# EAGLE design CAN Breakout 3.0 (EAGLE 9.5.1)
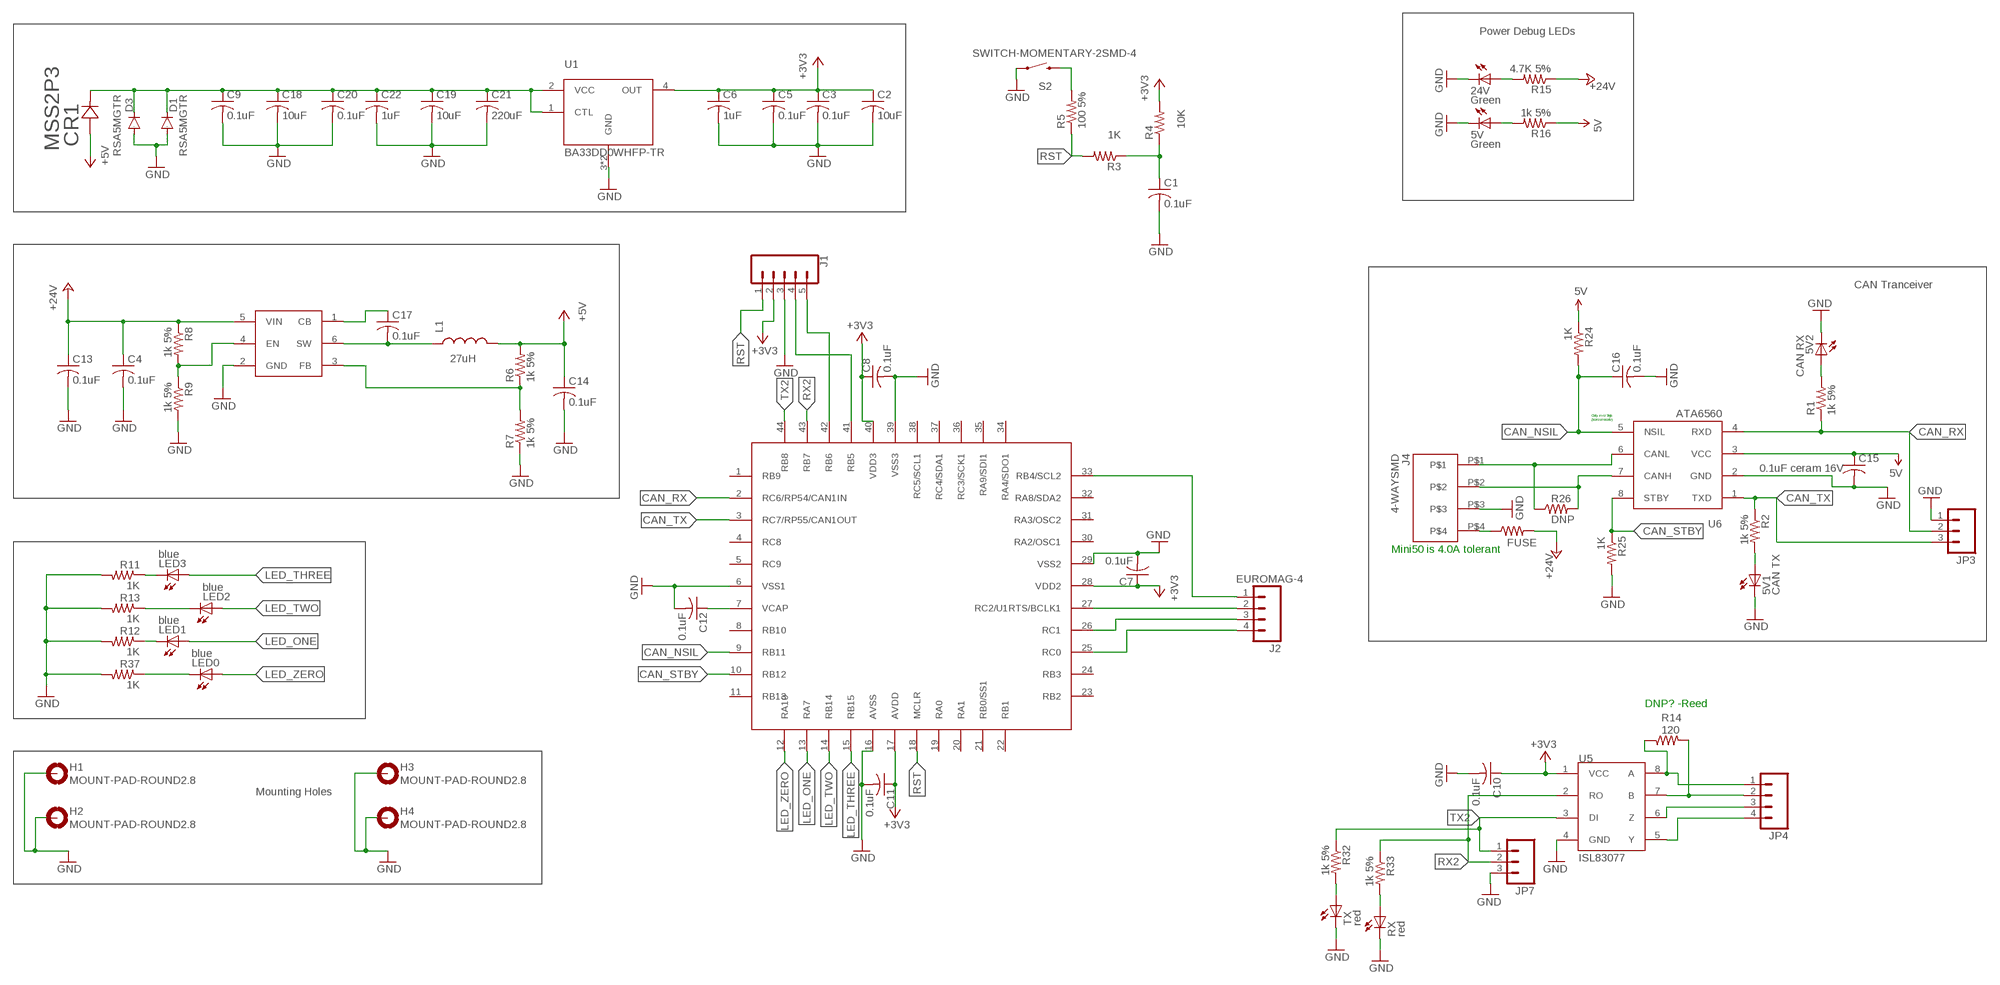
[diagram p0: schematic, sheet 1]

## Parts
5V  Green  LEDCHIP-LED0805  [CHIP-LED0805]
5V1  CAN TX  LEDCHIP-LED0805  [CHIP-LED0805]
5V2  CAN RX  LEDCHIP-LED0805  [CHIP-LED0805]
24V  Green  LEDCHIP-LED0805  [CHIP-LED0805]
C1  0.1uF  C-USC0805  [C0805]
C2  10uF  C-USC0805  [C0805]
C3  0.1uF  C-USC0805  [C0805]
C4  0.1uF  C-USC0805  [C0805]
C5  0.1uF  C-USC0805  [C0805]
C6  1uF  C-USC0805  [C0805]
C7  0.1uF  C-USC0805  [C0805]
C8  0.1uF  C-USC0805  [C0805]
C9  0.1uF  C-USC0805  [C0805]
C10  0.1uF  C-USC0805  [C0805]
C11  0.1uF  C-USC0805  [C0805]
C12  0.1uF  C-USC0805  [C0805]
C13  0.1uF  C-USC0805  [C0805]
C14  0.1uF  C-USC0805  [C0805]
C15  0.1uF ceram 16V  C-USC0805  [C0805]
C16  0.1uF  C-USC0805  [C0805]
C17  0.1uF  C-USC0805  [C0805]
C18  10uF  C-USC0805  [C0805]
C19  10uF  C-USC0805  [C0805]
C20  0.1uF  C-USC0805  [C0805]
C21  220uF  C-USC0805  [C0805]
C22  1uF  C-USC0805  [C0805]
CR1  MSS2P3  MSS2P3-M3/89ADIODE_MSP3V3-L  [DIODE_MSP3V3-L]
D1  RSA5MGTR  CGRM4004-G  [SOD-123_MINI-SMA]
D3  RSA5MGTR  CGRM4004-G  [SOD-123_MINI-SMA]
FUSE  RESISTOR1206  [1206]
H1  MOUNT-PAD-ROUND2.8  [2,8-PAD]
H2  MOUNT-PAD-ROUND2.8  [2,8-PAD]
H3  MOUNT-PAD-ROUND2.8  [2,8-PAD]
H4  MOUNT-PAD-ROUND2.8  [2,8-PAD]
J1  CONN_05  [1X05]
J2  EUROMAG-4  [M4]
J4  4-WAYSMD  [4-WAY-SMD-90D]
JP3  M03LOCK  [1X03_LOCK]
JP4  M04POLAR_LOCK  [MOLEX-1X4_LOCK]
JP7  M03LOCK  [1X03_LOCK]
L1  27uH  INDUCTOR1  [0805]
LED0  blue  LEDCHIPLED_0805  [CHIPLED_0805]
LED1  blue  LEDCHIPLED_0805  [CHIPLED_0805]
LED2  blue  LEDCHIPLED_0805  [CHIPLED_0805]
LED3  blue  LEDCHIPLED_0805  [CHIPLED_0805]
R1  1k 5%  R-US_M0805  [M0805]
R2  1k 5%  R-US_M0805  [M0805]
R3  1K  R-US_M0805  [M0805]
R4  10K  R-US_M0805  [M0805]
R5  100 5%  R-US_M0805  [M0805]
R6  1k 5%  R-US_M0805  [M0805]
R7  1k 5%  R-US_M0805  [M0805]
R8  1k 5%  R-US_M0805  [M0805]
R9  1k 5%  R-US_M0805  [M0805]
R11  1K  R-US_M0805  [M0805]
R12  1K  R-US_M0805  [M0805]
R13  1K  R-US_M0805  [M0805]
R14  120  R-US_M0805  [M0805]
R15  4.7K 5%  R-US_M0805  [M0805]
R16  1k 5%  R-US_M0805  [M0805]
R24  1K  R-US_M0805  [M0805]
R25  1K  R-US_M0805  [M0805]
R26  DNP  R-US_M0805  [M0805]
R32  1k 5%  R-US_M0805  [M0805]
R33  1k 5%  R-US_M0805  [M0805]
R37  1K  R-US_M0805  [M0805]
RX  red  LEDCHIP-LED0805  [CHIP-LED0805]
S2  SWITCH-MOMENTARY-2SMD-4  [TACTILE_SWITCH_TALL]
TX  red  LEDCHIP-LED0805  [CHIP-LED0805]
U1  BA33DD0WHFP-TR  [HRP5]
U2  DSPIC33EP512GP504  [TQFP-44]
U5  ISL83077  [SO08]
U6  ATA6560  [SOIC8]
U7  TPS560430YDBVR  [SOT23-6]

## Nets
5V [New Class]: C15.1 R16.1 R24.1 U6.3(VCC)
+3V3 [New Class]: C2.1 C3.1 C5.1 C6.1 C7.1 C8.1 C10.1 C11.1 J1.2 R4.2 U1.4(OUT) U2.17(AVDD) U2.28(VDD2) U2.40(VDD3) U5.1(VCC)
+5V [New Class]: C14.1 CR1.2 L1.2 R6.2
+24V [New Class]: C4.1 C13.1 FUSE.2 R8.1 R15.1 U7.5(VIN)
CAN_NSIL [New Class]: C16.1 R24.2 U2.9(RB11) U6.5(NSIL)
CAN_RX [New Class]: JP3.2 R1.1 U2.2(RC6/RP54/CAN1IN) U6.4(RXD)
CAN_STBY [New Class]: R25.1 U2.10(RB12) U6.8(STBY)
CAN_TX [New Class]: JP3.3 R2.1 U2.3(RC7/RP55/CAN1OUT) U6.1(TXD)
GND: 5V1.C 5V2.C 5V.C 24V.C C1.2 C2.2 C3.2 C4.2 C5.2 C6.2 C7.2 C8.2 C9.2 C10.2 C11.2 C12.2 C13.2 C14.2 C15.2 C16.2 C18.2 C19.2 C20.2 C21.2 C22.2 D1.A D3.A H1.B2,8(MOUNT) H2.B2,8(MOUNT) H3.B2,8(MOUNT) H4.B2,8(MOUNT) J1.3 J4.P$3 JP3.1 JP7.3 R7.1 R9.2 R11.2 R12.2 R13.2 R25.2 R37.2 RX.C S2.A2 TX.C U1.3(GND) U1.G(GND) U2.6(VSS1) U2.16(AVSS) U2.29(VSS2) U2.39(VSS3) U5.4(GND) U6.2(GND) U7.2(GND)
LED_ONE [New Class]: LED1.A U2.13(RA7)
LED_THREE [New Class]: LED3.A U2.15(RB15)
LED_TWO [New Class]: LED2.A U2.14(RB14)
LED_ZERO [New Class]: LED0.A U2.12(RA10)
N$1 [New Class]: 24V.A R15.2
N$2 [New Class]: J1.5 U2.42(RB6)
N$3 [New Class]: J2.2 U2.27(RC2/U1RTS/BCLK1)
N$4 [New Class]: J1.4 U2.41(RB5)
N$5 [New Class]: J2.3 U2.26(RC1)
N$6 [New Class]: C9.1 C18.1 C19.1 C20.1 C21.1 C22.1 CR1.1 D1.C D3.C U1.1(CTL) U1.2(VCC)
N$7 [New Class]: J2.1 U2.33(RB4/SCL2)
N$8 [New Class]: 5V2.A R1.2
N$9 [New Class]: J2.4 U2.25(RC0)
N$10 [New Class]: 5V.A R16.2
N$11 [New Class]: 5V1.A R2.2
N$12 [New Class]: LED0.C R37.1
N$14 [New Class]: LED2.C R13.1
N$15 [New Class]: J4.P$1 R26.1 U6.6(CANL)
N$16 [New Class]: LED1.C R12.1
N$17 [New Class]: R5.2 S2.B2
N$18 [New Class]: C1.1 R3.1 R4.1
N$19: FUSE.1 J4.P$4
N$20 [New Class]: JP4.2 R14.2 U5.7(B)
N$23 [New Class]: JP4.1 R14.1 U5.8(A)
N$24 [New Class]: JP4.3 U5.6(Z)
N$25 [New Class]: JP4.4 U5.5(Y)
N$27 [New Class]: LED3.C R11.1
N$29 [New Class]: C17.2 L1.1 U7.6(SW)
N$31 [New Class]: R8.2 R9.1 U7.4(EN)
N$32 [New Class]: C17.1 U7.1(CB)
N$33 [New Class]: R6.1 R7.2 U7.3(FB)
N$35 [New Class]: R32.2 TX.A
N$36 [New Class]: J4.P$2 R26.2 U6.7(CANH)
N$37 [New Class]: C12.1 U2.7(VCAP)
N$43 [New Class]: R33.2 RX.A
RST [New Class]: J1.1 R3.2 R5.1 U2.18(MCLR)
RX2 [New Class]: JP7.2 R33.1 U2.43(RB7) U5.2(RO)
TX2 [New Class]: JP7.1 R32.1 U2.44(RB8) U5.3(DI)
Unconnected: U2.1(RB9) U2.4(RC8) U2.5(RC9) U2.8(RB10) U2.11(RB13) U2.19(RA0) U2.20(RA1) U2.21(RB0/SS1) U2.22(RB1) U2.23(RB2) U2.24(RB3) U2.30(RA2/OSC1) U2.31(RA3/OSC2) U2.32(RA8/SDA2) U2.34(RA4/SDO1) U2.35(RA9/SDI1) U2.36(RC3/SCK1) U2.37(RC4/SDA1) U2.38(RC5/SCL1)

## Notes on the sheet
- Power Debug LEDs
- CAN Tranceiver
- Only ever high 
    (normal mode)
- Mini50 is 4.0A tolerant
- DNP? -Reed
- Mounting Holes

## Library data of the parts
5V 5V1 5V2 24V LED0 LED1-LED3 RX TX = adafruit:LED: LED OSRAM: - CHIPLED LG R971, LG N971, LY N971, LG Q971, LY Q971, LO R971, LY R971 LH N974, LH R974 LS Q976, LO Q976, LY Q976 LO Q996 - Hyper CHIPLED LW Q18S LB Q993, LB Q99A, LB R99A - SideLED LS A670, LO A670, LY A670, LG A670, LP A670 LB A673, LV A673, LT A673, LW A673 LH A674 LY A675 LS A676, LA A676, LO A676, LY A676, LW A676 LS A679, LY A679, LG A679 - Hyper Micro SIDELED® LS Y876, LA Y876, LO Y876, LY Y876 LT Y87S - SmartLED LW L88C, LW L88S LB L89C, LB L89S, LG L890 LS L89K, LO L89K, LY L89K LS L896, LA L896, LO L896, LY L896 - TOPLED LS T670, LO T670, LY T670, LG T670, LP T670 LSG T670, LSP T670, LSY T670, LOP T670, LYG T670 LG T671, LOG T671, LSG T671 LB T673, LV T673, LT T673, LW T673 LH T674 LS T676, LA T676, LO T676, LY T676, LB T676, LH T676, LSB T676, LW T676 LB T67C, LV T67C, LT T67C, LS T67K, LO T67K, LY T67K, LW E67C LS E67B, LA E67B, LO E67B, LY E67B, LB E67C, LV E67C, LT E67C LW T67C LS T679, LY T679, LG T679 LS T770, LO T770, LY T770, LG T770, LP T770 LB T773, LV T773, LT T773, LW T773 LH T774 LS E675, LA E675, LY E675, LS T675 LS T776, LA T776, LO T776, LY T776, LB T776 LHGB T686 LT T68C, LB T68C - Hyper Mini TOPLED® LB M676 - Mini TOPLED Santana® LG M470 LS M47K, LO M47K, LY M47K Source: http://www.osram.convergy.de/
C1-C22 = adafruit:C-US: CAPACITOR, American symbol
CR1 = MICRO-SMP:MSS2P3-M3/89A; MANUFACTURER_PART_NUMBER: MSS2P3M389A; VENDOR: Vishay
D1 D3 = diode:CGRM400*-G: Molded plasitc,JEDEC SOD-123/Mini SMA Source: Comchip CGRM4001-G.pdf
FUSE = SparkFun-Resistors:RESISTOR: Resistor Basic schematic elements and footprints for 0603, 1206, and PTH resistors.
H1-H4 = holes:MOUNT-PAD-ROUND: MOUNTING PAD, round
J1 = SparkFun-Connectors:CONN_05: Multi connection point. Often used as Generic Header-pin footprint for 0.1 inch spaced/style header connections On any of the 0.1 inch spaced packages, you can populate with these: Break Away Headers - Straight <https://www.sparkfun.com/products/116> (PRT-00116) Break Away Male Headers - Right Angle <https://www.sparkfun.com/products/553> (PRT-00553) Female Headers <https://www.sparkfun.com/products/115> (PRT-00115) Break Away Headers - Machine Pin <https://www.sparkfun.com/products/117> (PRT-00117) Break Away Female Headers - Swiss Machine Pin <https://www.sparkfun.com/products/743> (PRT-00743) For SCREWTERMINALS and SPRING TERMINALS visit here: Screw Terimnals on SparkFun.com <https://www.sparkfun.com/search/results?term=Screw+Terminals> (5mm/3.5mm/2.54mm spacing) This device is also useful as a general connection point to wire up your design to another part of your project. Our various solder wires solder well into these plated through hole pads. Hook-Up Wire - Assortment (Stranded, 22 AWG) <https://www.sparkfun.com/products/11375> (PRT-11375) Hook-Up Wire - Assortment (Solid Core, 22 AWG) <https://www.sparkfun.com/products/11367> (PRT-11367) View the entire wire category on our website here <https://www.sparkfun.com/categories/141> Special notes: Molex polarized connector foot print use with SKU : PRT-08231 with associated crimp pins and housings. 1MM SMD Version SKU: PRT-10208
J2 = NASA_LIB_08-24-17:EUROMAG-4
J4 = Molex-Auto-Connector:4-WAY
JP3 JP7 = SparkFun-Connectors:M03: Header 3 Standard 3-pin 0.1" header. Use with straight break away headers (SKU : PRT-00116), right angle break away headers (PRT-00553), swiss pins (PRT-00743), machine pins (PRT-00117), and female headers (PRT-00115). Molex polarized connector foot print use with SKU : PRT-08232 with associated crimp pins and housings.
JP4 = SparkFun-Connectors:M04: Header 4 Standard 4-pin 0.1" header. Use with straight break away headers (SKU : PRT-00116), right angle break away headers (PRT-00553), swiss pins (PRT-00743), machine pins (PRT-00117), and female headers (PRT-00115). Molex polarized connector foot print use with SKU : PRT-08231 with associated crimp pins and housings. 1MM SMD Version SKU: PRT-10208
L1 = UA_NASA_RMC-Inductors:INDUCTOR
R1-R9 R11-R16 R24-R26 R32 R33 R37 = adafruit:R-US_: RESISTOR, American symbol
S2 = SparkFun-Electromechanical:SWITCH-MOMENTARY-2: Various NO switches- pushbuttons, reed, etc; PROD_ID: SWCH-11966
U1 = NASA_LIB_08-24-17:BA33DD0WHFP-TR
U2 = NASA_LIB_08-24-17:DSPIC33EP512GP504
U5 = NASA_LIB:ISL83077
U6 = NASAAtmel:ATA6560
U7 = adafruit_2:TPS560430YDBVR

## Board
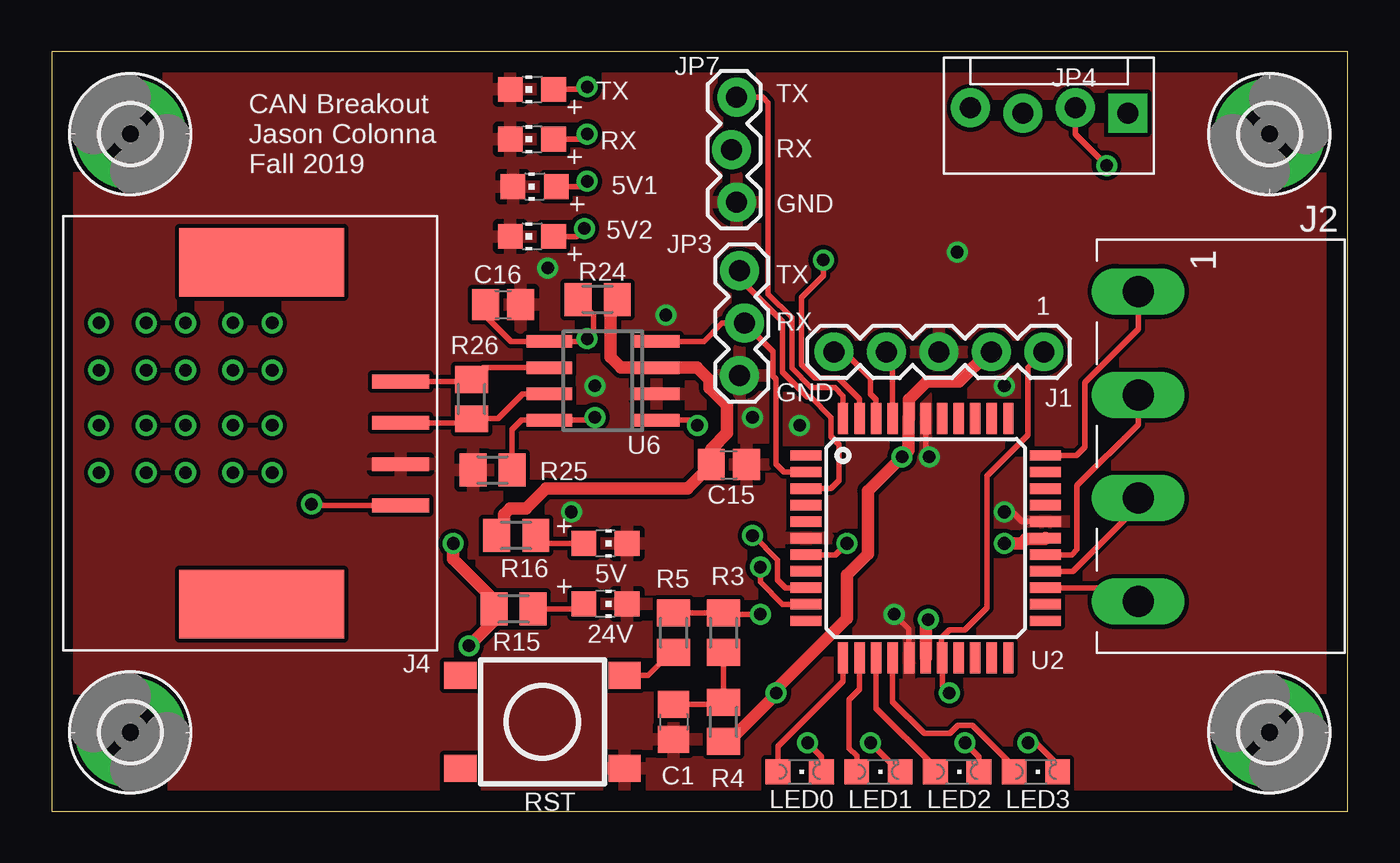
[diagram p1: board, top side]
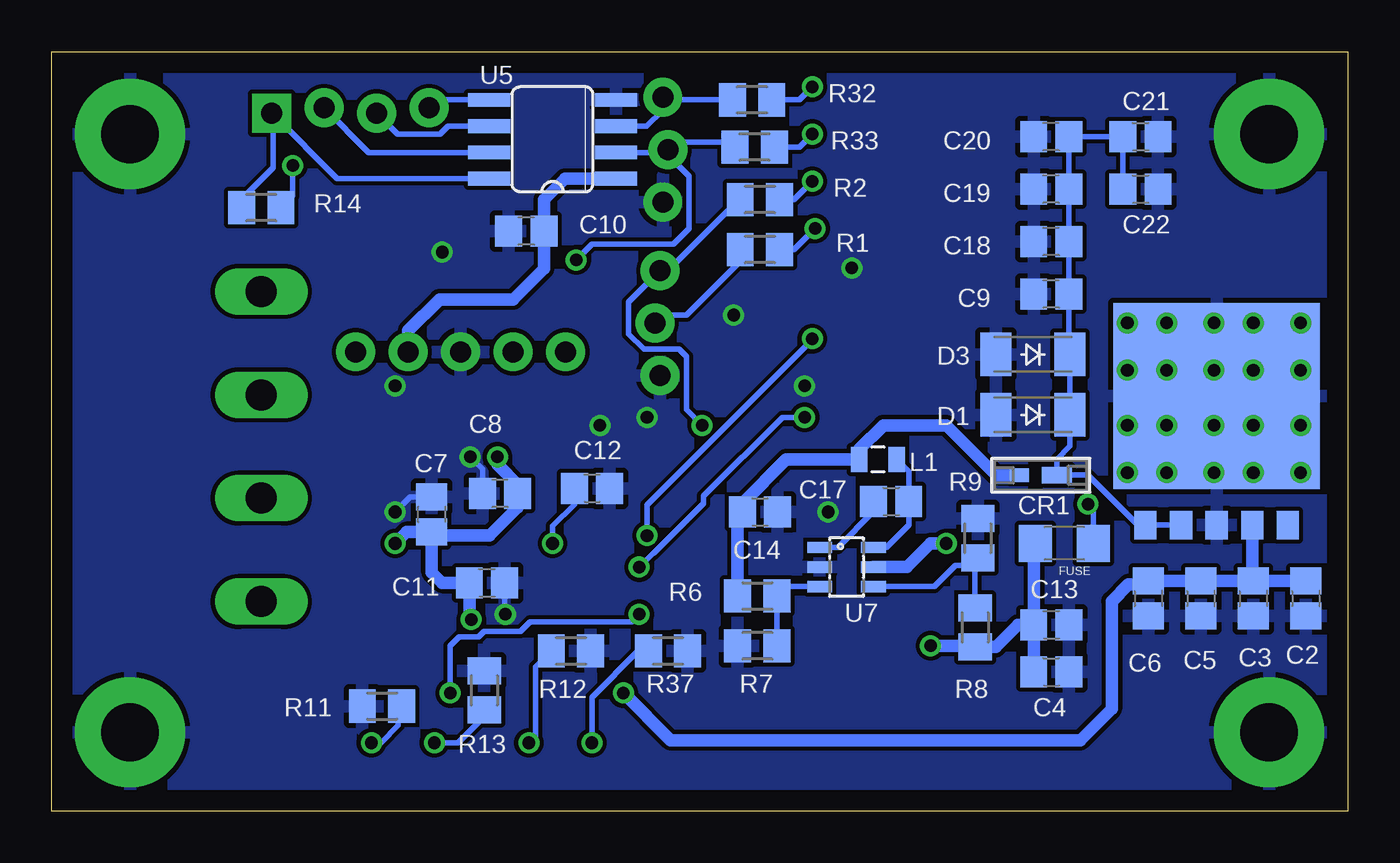
[diagram p2: board, bottom side, seen from below]

Size 62.72 x 36.75 mm. Coordinates in mm from the lower left corner, seen from the top.
Outline: 0,0 62.72,0 62.72,36.75 0,36.75 0,0
Copper layers (1*16): Top 0.035mm / dielectric 1.5mm / Bottom 0.035mm
Design rules "default *": minimum track width 10mil, minimum drill 24mil, track to track 8mil, track to pad 8mil, pad to pad 8mil, via to via 8mil, smd to smd 8mil, copper to edge 40mil, drill to drill 8mil, minimum pad ring 10mil, minimum via ring 8mil, stop-mask expansion 4mil, vias tented up to drill 0mil, thermal gap 10mil

### Footprints (pad centres in the part's own frame; a part is rotated, then mirrored left to right if it is on the bottom)
CHIP-LED0805 = smd 1.2 x 1.2: A 0,-1.05; C 0,1.05
C0805 = smd 1.3 x 1.5: 1 -0.85,0; 2 0.85,0
DIODE_MSP3V3-L = smd 1.448 x 0.787: 1 -0.775,0 | smd 0.914 x 0.66: 2 1.041,0
SOD-123_MINI-SMA = smd 1.5 x 2.1: A 1.8,0; C -1.8,0
1206 = smd 1.6 x 1.8: 1 -1.4,0; 2 1.4,0
2,8-PAD = drill 2.8 pad 5.334: B2,8 0,0
1X05 = drill 1.016 pad 1.88: 1 0,0; 2 2.54,0; 3 5.08,0; 4 7.62,0; 5 10.16,0
M4 = drill 1.5 long: 1 0,0; 2 5,0; 3 10,0; 4 15,0
4-WAY-SMD-90D = smd 0.66 x 2.75: P$1 -2.5,6.72; P$2 -0.5,6.72; P$3 1.5,6.72; P$4 3.5,6.72 | smd 3.32 x 8: P$5 -8.27,0; P$6 8.27,0
1X03_LOCK = drill 1.016 pad 1.88: 1 0,0.127; 2 2.54,-0.127; 3 5.08,0.127
MOLEX-1X4_LOCK = drill 1.016 pad 1.88 square: 1 0,0.127 | drill 1.016 pad 1.88: 2 2.54,-0.127; 3 5.08,0.127; 4 7.62,-0.127
0805 = smd 0.8 x 1.2: 1 -0.9,0; 2 0.9,0
CHIPLED_0805 = smd 1.2 x 1.2: A 0,-1.05; C 0,1.05
M0805 = smd 1.3 x 1.6: 1 -0.95,0; 2 0.95,0
TACTILE_SWITCH_TALL = smd 1.55 x 1.3: A1 -3.975,-2.25; A2 3.975,-2.25; B1 -3.975,2.25; B2 3.975,2.25
HRP5 = smd 1.07 x 1.37: 1 -3.44,0; 2 -1.72,0; 3 0,0; 4 1.72,0; 5 3.44,0 | smd 10 x 9: G 0,6.254
TQFP-44 = smd 1.5 x 0.5: 1 -5.8,4; 2 -5.8,3.2; 3 -5.8,2.4; 4 -5.8,1.6; 5 -5.8,0.8; 6 -5.8,0; 7 -5.8,-0.8; 8 -5.8,-1.6; 9 -5.8,-2.4; 10 -5.8,-3.2; 11 -5.8,-4; 23 5.8,-4; 24 5.8,-3.2; 25 5.8,-2.4; 26 5.8,-1.6; 27 5.8,-0.8; 28 5.8,0; 29 5.8,0.8; 30 5.8,1.6; 31 5.8,2.4; 32 5.8,3.2; 33 5.8,4 | smd 0.5 x 1.5: 12 -4,-5.8; 13 -3.2,-5.8; 14 -2.4,-5.8; 15 -1.6,-5.8; 16 -0.8,-5.8; 17 0,-5.8; 18 0.8,-5.8; 19 1.6,-5.8; 20 2.4,-5.8; 21 3.2,-5.8; 22 4,-5.8; 34 4,5.8; 35 3.2,5.8; 36 2.4,5.8; 37 1.6,5.8; 38 0.8,5.8; 39 0,5.8; 40 -0.8,5.8; 41 -1.6,5.8; 42 -2.4,5.8; 43 -3.2,5.8; 44 -4,5.8
SO08 = smd 0.66 x 2.032: 1 -1.905,-3.073; 2 -0.635,-3.073; 3 0.635,-3.073; 4 1.905,-3.073; 5 1.905,3.073; 6 0.635,3.073; 7 -0.635,3.073; 8 -1.905,3.073
SOIC8 = smd 0.6 x 2.2: 1 -1.905,-2.6; 2 -0.635,-2.6; 3 0.635,-2.6; 4 1.905,-2.6; 5 1.905,2.6; 6 0.635,2.6; 7 -0.635,2.6; 8 -1.905,2.6
SOT23-6 = smd 0.55 x 1.2: 1 -0.95,-1.3; 2 0,-1.3; 3 0.95,-1.3; 4 0.95,1.3; 5 0,1.3; 6 -0.95,1.3

### Placement (x,y rotation side)
5V  26.8,12.95 270 top
5V1  23.37,30.23 90 top
5V2  23.24,27.81 90 top
24V  26.8,10.03 270 top
C1  30.1,4.32 270 top
C2  2.03,10.29 270 bottom
C3  4.57,10.29 270 bottom
C4  14.35,6.73 0 bottom
C5  7.11,10.29 270 bottom
C6  9.65,10.29 270 bottom
C7  44.32,14.35 90 bottom
C8  41.02,15.37 180 bottom
C9  14.35,25.02 180 bottom
C10  39.75,28.07 180 bottom
C11  41.66,11.05 0 bottom
C12  36.58,15.62 0 bottom
C13  14.35,9.02 0 bottom
C14  28.45,14.48 0 bottom
C15  32.77,16.76 0 top
C16  21.84,24.51 0 top
C17  22.1,14.99 0 bottom
C18  14.35,27.56 180 bottom
C19  14.35,30.1 180 bottom
C20  14.35,32.64 180 bottom
C21  10.03,32.64 0 bottom
C22  10.03,30.1 0 bottom
CR1  14.86,16.26 180 bottom
D1  15.24,19.18 180 bottom
D3  15.24,22.1 180 bottom
FUSE  13.72,12.95 180 bottom
H1  58.93,3.81 90 top
H2  58.93,32.77 0 top
H3  3.81,32.77 270 top
H4  3.81,3.81 90 top
J1  48.01,22.23 180 top
J2  52.58,25.15 270 top
J4  10.16,18.29 270 top
JP3  33.4,21.08 90 top
JP4  52.07,33.91 180 top
JP7  33.02,34.54 270 top
L1  22.73,17.02 180 bottom
LED0  36.2,1.91 270 top
LED1  40.01,1.91 270 top
LED2  43.81,1.91 270 top
LED3  47.62,1.91 270 top
R1  28.45,27.18 0 bottom
R2  28.45,29.59 0 bottom
R3  32.51,8.64 90 top
R4  32.51,4.32 270 top
R5  30.1,8.64 270 top
R6  28.57,10.41 180 bottom
R7  28.57,8 0 bottom
R8  18.03,8.89 90 bottom
R9  17.91,13.21 90 bottom
R11  46.74,5.08 180 bottom
R12  37.59,7.75 0 bottom
R13  41.78,5.84 90 bottom
R14  52.58,29.21 0 bottom
R15  22.35,9.78 0 top
R16  22.48,13.34 0 top
R24  26.42,24.77 180 top
R25  21.34,16.51 180 top
R26  20.32,19.94 270 top
R32  28.83,34.42 0 bottom
R33  28.7,32.13 0 bottom
R37  32.89,7.75 0 bottom
RX  23.24,32.51 90 top
S2  23.75,4.32 0 top
TX  23.24,34.92 90 top
U1  6.35,13.84 0 bottom
U2  42.29,13.21 0 top
U5  38.48,32.51 90 bottom
U6  26.67,20.83 90 top
U7  24.26,11.81 270 bottom

### Tracks (layer width: path | path; a pad name or v marks a point on that pad's centre or on a via)
5V
  Top 0.61: R24.1 27.3,24.77 27.05,24.52 27.05,21.97 27.56,21.46 U6.3 31.23,21.46 31.83,20.86 31.83,20.48 32.68,19.63 32.68,18.29 31.92,17.53 C15.1 30.77,15.62 23.93,15.62 22.95,14.64 22.19,14.64 21.89,14.35 21.89,13.96 21.53,13.6 R16.1
+3V3  (via drill 0.61)
  Top 0.61: U2.28 48.05,13.17 47.13,13.17 46.92,12.95 v46.1,12.95 | J1.2 45.35,22.23 43.91,20.78 42.34,20.78 41.49,19.93 U2.40 41.45,19.05 41.45,17.45 v41.15,17.14 39.5,15.49 39.5,12.45 38.48,11.43 38.48,9.32 35.05,5.89 v35.05,5.71 35.05,5.64 32.78,3.37 R4.2 | U2.17 42.29,9.14 v42.41,9.27
  Bottom 0.61: C3.1 C2.1 | C3.1 C5.1 C6.1 9.81,10.98 10.61,10.98 11.43,10.16 11.43,4.95 12.95,3.43 32.77,3.43 v35.05,5.71 | C3.1 4.63,11.2 U1.4 | U5.1 37.88,30.61 38.9,29.59 C10.1 38.9,26.25 40.39,24.77 43.96,24.77 45.47,23.26 J1.2 | v42.41,9.27 42.51,9.36 C11.1 43.81,11.05 44.32,11.56 C7.1 | v46.1,12.95 45.55,13.5 C7.1 | C7.1 44.16,13.34 41.53,13.34 40.17,14.69 C8.1 40.17,15.79 41.15,16.76 v41.15,17.14
+5V
  Bottom 0.61: CR1.2 17.02,16.26 19.43,18.67 22.48,18.67 23.63,17.52 L1.2 27.18,17.02 29.3,14.9 C14.1 29.52,14.25 R6.2
+24V  (via drill 0.61)
  Top 0.61: v19.43,12.95 19.43,12.19 21.4,10.22 R15.1 21.4,9.21 v20.19,8
  Bottom 0.61: U7.5 21.34,11.81 20.19,12.95 v19.43,12.95 | v20.19,8 18.09,8 R8.1 17.04,7.94 15.96,9.02 C13.1 | C13.1 C4.1 | FUSE.2 15.2,12.87 C13.1
CAN_NSIL  (via drill 0.61)
  Top 0.254: C16.1 20.99,23.96 22.23,22.73 U6.5 25.78,22.73 v25.91,22.86 26.23,23.18 26.23,24 R24.2 | U2.9 35.51,10.81 35.13,11.19 35.13,12.16 33.95,13.34 v33.91,13.34
  Bottom 0.254: v33.91,13.34 33.91,14.82 25.91,22.82 v25.91,22.86
CAN_RX
  Top 0.254: U2.2 35.43,16.41 35.05,16.79 35.05,20.9 34.9,21.05 34.9,22.25 JP3.2 32.45,23.62 31.56,22.73 U6.4
  Bottom 0.254: JP3.2 33.15,24 32,24 29.34,26.67 29.34,27.12 R1.1
CAN_STBY  (via drill 0.61)
  Top 0.254: R25.1 22.29,18.48 22.73,18.92 U6.8 26.16,18.92 v26.29,19.05 | U2.10 35.37,10.01 34.29,11.09 v34.29,11.81
  Bottom 0.254: v34.29,11.81 33.6,12.5 33.56,12.5 31.17,14.89 31.17,15.24 27.36,19.05 v26.29,19.05
CAN_TX  (via drill 0.61)
  Top 0.254: U6.1 30.99,18.92 v31.24,18.67 | U2.3 37.71,15.61 38.1,16 38.1,17.73 37.71,18.12 37.71,19.06 36.73,20.04 36.56,20.04 35.36,21.24 35.36,23.7 33.27,25.78 JP3.3
  Bottom 0.254: R2.1 29.46,29.59 32.89,26.16 JP3.3 34.8,24.64 34.8,23.1 34.05,22.35 32.37,22.35 32,21.99 32,19.43 v31.24,18.67
GND  (via drill 0.61)
  Top 0.254: v42.47,17.14 42.29,17.32 U2.39 | U2.16 41.49,8.8 v40.77,9.53 | v46.1,14.48 46.48,14.48 46.95,14.01 U2.29
  Bottom 0.254: v42.47,17.14 41.87,16.55 C8.2 | C11.2 40.81,9.56 v40.77,9.53 | C7.2 45.38,15.2 v46.1,14.48
  other vias: 24,26.29 26.29,20.57 29.72,24 33.91,19.05 36.2,18.67 46.1,20.57 25.15,14.48 43.81,27.05
  pour Bottom: 0.38,36.58 0.38,0.38 62.48,0.38 62.48,36.96 0.76,36.96
  pour Top: 0.38,36.58 0.38,0.38 62.48,0.38 62.48,36.58
LED_ONE
  Top 0.254: LED1.A 38.95,2.67 38.57,3.05 38.57,5.38 39.09,5.9 U2.13
LED_THREE
  Top 0.254: LED3.A 46.58,2.11 44.54,4.14 43.85,4.14 43.47,3.76 42.23,3.76 40.69,5.29 U2.15
LED_TWO
  Top 0.254: LED2.A 42.77,2.11 39.89,4.98 U2.14
LED_ZERO
  Top 0.254: LED0.A 35.15,3.14 38.29,6.29 U2.12
N$1
  Top 0.254: 24V.A 25.49,9.78 R15.2
N$2
  Top 0.254: J1.5 38.35,22.23 39.62,20.95 39.62,20.19 39.89,19.93 U2.42
N$3
  Top 0.254: U2.27 49.37,12.41 49.62,12.66 49.62,15.75 52.58,18.71 J2.2
N$4
  Top 0.254: J1.4 40.69,21.92 U2.41
N$5
  Top 0.254: J2.3 52.58,14.77 49.42,11.61 U2.26
N$6
  Bottom 0.254: C22.1 C21.1 C20.1 C19.1 C18.1 C9.1 13.5,22.16 D3.C D1.C 13.44,17.66 14.08,17.02 CR1.1 12.58,16.26 10.17,13.84 U1.1 U1.2
N$7
  Top 0.254: U2.33 49.59,17.21 50,17.61 50,20.75 52.58,23.33 J2.1
N$8  (via drill 0.61)
  Top 0.254: v25.78,28.19 25.4,27.81 5V2.A
  Bottom 0.254: R1.2 26.8,27.18 v25.78,28.19
N$9
  Top 0.254: U2.25 51.92,10.81 J2.4
N$10
  Top 0.254: 5V.A 23.81,12.95 R16.2
N$11  (via drill 0.61)
  Top 0.254: v25.91,30.48 25.65,30.23 5V1.A
  Bottom 0.254: R2.2 26.8,29.59 v25.91,30.48
N$12  (via drill 0.61)
  Top 0.254: v36.58,3.3 37.24,2.63 LED0.C
  Bottom 0.254: v36.58,3.3 36.58,5.51 34.34,7.75 R37.1
N$13  (via drill 0.61)
  other vias: 2.29,23.62
N$14  (via drill 0.61)
  Top 0.254: v44.2,3.3 44.87,2.63 LED2.C
  Bottom 0.254: R13.1 41.78,4.57 43.05,3.3 v44.2,3.3
N$15
  Top 0.254: J4.P$1 20.22,20.79 R26.1 20.89,21.46 U6.6
N$16  (via drill 0.61)
  Top 0.254: LED1.C 41.02,1.91 v39.62,3.3
  Bottom 0.254: v39.62,3.3 39.3,3.62 39.3,6.99 R12.1
N$17
  Top 0.254: R5.2 29.98,7.69 28.87,6.57 S2.B2
N$18
  Top 0.254: C1.1 32.41,5.17 R4.1 R3.1
N$19  (via drill 0.61)
  Top 0.254: J4.P$4 12.64,14.79 v12.57,14.86
  Bottom 0.254: FUSE.1 12.32,14.6 v12.57,14.86
N$20  (via drill 0.61)
  Top 0.254: v51.05,31.24 49.53,32.77 JP4.2
  Bottom 0.254: U5.7 47.37,31.88 JP4.2 | R14.2 51.05,29.78 v51.05,31.24
N$21  (via drill 0.61)
  other vias: 4.57,23.62
N$22  (via drill 0.61)
  other vias: 2.29,21.34
N$23
  Bottom 0.254: U5.8 48.9,30.61 52.01,33.72 | 52.01,33.72 JP4.1 | R14.1 53.53,29.61 52.01,31.13 52.01,33.72
N$24
  Bottom 0.254: U5.6 43.54,33.15 43.92,32.77 45.97,32.77 JP4.3
N$25
  Bottom 0.254: U5.5 44.07,34.42 JP4.4
N$26  (via drill 0.61)
  other vias: 6.48,23.62
N$27  (via drill 0.61)
  Top 0.254: LED3.C 48.67,2.25 47.62,3.3 v47.24,3.3
  Bottom 0.254: R11.1 45.94,4.92 45.94,4.14 46.78,3.3 v47.24,3.3
N$28  (via drill 0.61)
  other vias: 2.29,18.67
N$29
  Bottom 0.254: L1.1 21.25,16.43 C17.2 21.25,13.85 22.33,12.76 U7.6
N$30  (via drill 0.61)
  other vias: 8.76,23.62
N$31
  Bottom 0.254: U7.4 20,10.86 18.98,11.88 18.29,11.88 R9.1 18.03,12.13 R8.2
N$32
  Bottom 0.254: U7.1 24.68,12.76 22.95,14.49 C17.1
N$33
  Bottom 0.254: U7.3 27.18,10.86 R6.1 R7.2
N$34  (via drill 0.61)
  other vias: 2.29,16.38
N$35  (via drill 0.61)
  Top 0.254: v25.91,35.05 25.78,34.92 TX.A
  Bottom 0.254: R32.2 26.54,34.42 v25.91,35.05
N$36
  Top 0.254: U6.7 22.79,20.19 21.59,18.99 R26.2 20.12,18.79 J4.P$2
N$37  (via drill 0.61)
  Top 0.254: U2.7 37.94,12.41 v38.48,12.95
  Bottom 0.254: C12.1 37.43,14.85 38.48,13.79 v38.48,12.95
N$38  (via drill 0.61)
  other vias: 10.67,23.62
N$39  (via drill 0.61)
  other vias: 6.48,18.67
N$40  (via drill 0.61)
  other vias: 4.57,21.34
N$41  (via drill 0.61)
  other vias: 4.57,18.67
N$42  (via drill 0.61)
  other vias: 4.57,16.38
N$43  (via drill 0.61)
  Top 0.254: v25.91,32.77 25.65,32.51 RX.A
  Bottom 0.254: R33.2 26.54,32.13 v25.91,32.77
N$45  (via drill 0.61)
  other vias: 6.48,21.34
N$47  (via drill 0.61)
  other vias: 6.48,16.38
N$49  (via drill 0.61)
  other vias: 8.76,21.34
N$50  (via drill 0.61)
  other vias: 8.76,18.67
N$51  (via drill 0.61)
  other vias: 8.76,16.38
N$53  (via drill 0.61)
  other vias: 10.67,21.34
N$54  (via drill 0.61)
  other vias: 10.67,18.67
N$55  (via drill 0.61)
  other vias: 10.67,16.38
RST  (via drill 0.61)
  Top 0.254: J1.1 47.24,21.46 47.24,18.21 45.26,16.23 45.26,9.83 44.2,8.76 43.43,8.76 43.05,8.38 43.05,7.45 U2.18 43.09,6.06 v43.43,5.71 | R5.1 R3.2 32.57,9.53 v34.29,9.53
  Bottom 0.254: v34.29,9.53 34.67,9.14 39.58,9.14 40.04,8.69 41.8,8.69 42.06,8.43 43.01,8.43 43.43,8 v43.43,5.71
RX2  (via drill 0.61)
  Top 0.254: U2.43 39.09,19.95 38.08,20.95 36.94,20.95 36.27,21.62 36.27,24.84 37.34,25.91 v37.34,26.67
  Bottom 0.254: v37.34,26.67 36.58,27.43 32.64,27.43 31.88,28.19 31.88,30.73 33.02,31.88 | R33.1 29.65,32.19 29.84,32.38 32.51,32.38 JP7.2 33.02,31.88 | U5.2 33.02,31.88
TX2
  Top 0.254: U2.44 38.29,20.1 37.89,20.5 36.75,20.5 35.81,21.43 35.81,23.89 34.67,25.03 34.67,34.29 34.42,34.54 JP7.1
  Bottom 0.254: U5.3 33.93,33.15 33.15,33.93 JP7.1 32.77,34.54 32.64,34.42 R32.1

### Text on the board
tNames: JP4 | TX | RX | CAN Breakout / Jason Colonna / Fall 2019 | GND | TX | 1 | RX | GND | RST
tValues: Put LED 1-8 in single line on one edge of board - used for 8 bits / Number them 1-8 | Connectors, button, and LEDS go on the top